# Altium schematic sheet RS485_tranceiver.SchDoc
size A3; SheetNumber: 6; SheetTotal: 7
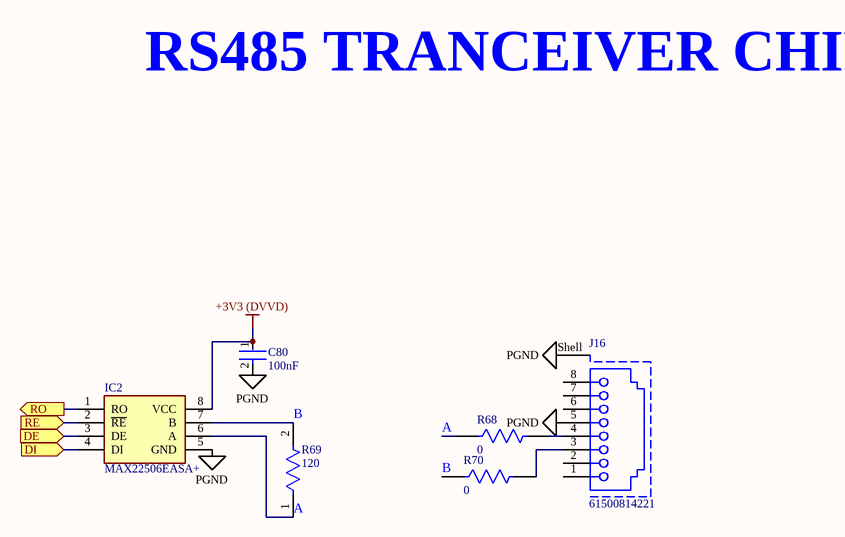
[diagram p0: RS485_tranceiver.SchDoc]

## Parts
C80  100nF  [FP-GRM15-MFG]
IC2  MAX22506EASA+  [SOIC127P600X175-8N]
J16  61500814221  [61500814221]
R68  0  [FP-CRCW1206-MFG]
R69  120  [FP-CRCW1206-MFG]
R70  0  [FP-CRCW1206-MFG]

## Ports
DE (in, see TOP_scheet[3C]), DI (in, see TOP_scheet[3C]), RE (in, see TOP_scheet[3C]), RO (out, see TOP_scheet[3C])

## Nets
+3V3 (DVVD): C80.1 IC2.8(VCC)
PGND: C80.2 IC2.5(GND) J16.5 J16.Shell
A: IC2.6(A) R68.1 R69.1
B: IC2.7(B) R69.2 R70.1
DE: IC2.3(DE) ; port DE
DI: IC2.4(DI) ; port DI
RE: IC2.2(~{RE}) ; port RE
RO: IC2.1(RO) ; port RO
NetJ16_3: J16.3 R70.2
NetJ16_4: J16.4 R68.2

Not connected (* = marked no-connect by the designer): J16 1 2 6 7 8

## Notes on the sheet
- RS485 TRANCEIVER CHIP

## Library data of the parts
C80 = CMP-2100-03641-2: CAP CER 0.1UF 16V X7R 0402; Manufacturer Part Number: GRM155R71C104KA88D; Manufacturer: Murata; Eurocircuits generic parts: GPC0402104; Standoff Height: 0mm; Tolerance: 10%; Voltage Rating: 16Vdc; Material: Ceramic; Capacitance: 0.10μF; Value: 0.10μF; RoHS: TRUE; Temperature Characteristic: X7R; Octopart: https://octopart.com/grm155r71c104ka88d-murata-196880; Digikey Description: CAP CER 0.1UF 16V X7R 0402; Device Class L3: Ceramic Capacitors; Height: 0.55mm; ComponentLink2Description: Datasheet; Temperature Range Low: -55°C; Ipc Land Pattern Name: CAPC10050X219; ComponentLink2URL: https://search.murata.co.jp/Ceramy/image/img/A01X/G101/ENG/GRM155R71H471KA01-01A.pdf; Device Class L1: Passive Components; Lead Free: yes; Category: Cap; Package: GRM15; Temperature: -55°C to +125°C; Device Class L2: Capacitors; Temperature Range High: +125°C; Mouser Description: 0402 0.1 uF 16V ±10 % Tolerance X7R SMT Multilayer Ceramic Capacitor
IC2 = MAX22506EASA+: Integrated Circuit; Manufacturer_Name: Analog Devices; Datasheet Link: https://datasheets.maximintegrated.com/en/ds/MAX22506E.pdf; Height: 1.75mm; Manufacturer_Part_Number: MAX22506EASA+; Mouser Part Number: 700-MAX22506EASA+; Mouser Price/Stock: https://www.mouser.co.uk/ProductDetail/Analog-Devices-Maxim-Integrated/MAX22506EASA%2b?qs=DRkmTr78QARfKAj85YrvXQ%3D%3D; Arrow Part Number: MAX22506EASA+; Arrow Price/Stock: https://www.arrow.com/en/products/max22506easa/maxim-integrated?region=nac
J16 = CMP-1502-01695-2: NexarPartId: 8917800; Number of Contacts: 8; Operating Supply Voltage: 120V; Gender: Female; Contact Resistance: 20mΩ; Number of Ports: 1; Direction: Down; Shielding: Shielded; Insulation Resistance: 500MΩ; Current Rating: 1.5A; Connector Type: RJ45, Socket; Mount: PCB, Through Hole; Housing Material: PBT; RoHS: Compliant; Depth: 21.2mm; Max Operating Temperature: 85°C; Contact Material: Copper; REACH SVHC: Unknown; Voltage Rating (DC): 120V; Orientation: Right Angle; Number of Positions: 8; Number of Rows: 1; Insulation Material: PBT; Width: 15.88mm; Flammability Rating: UL94 V-0; Termination: Through Hole; Min Operating Temperature: -40°C; Voltage Rating (AC): 120V; Length: 13.65mm; Height: 19.95mm; Contact Plating: Gold; Color: Black
R68 R70 = CMP-00030-39388935-1: CRCW12060000ZSTA Zero Ohm Resistor, Jumper, 1206 [3216 Metric], Thick Film, 250 mW, Surface Mount; Voltage Rating (DC): 200V; Max Power Dissipation: 250mW; Temperature Coefficient: 100ppm/°C; Resistance: 0Ω; Packaging: Cut Tape; Lead Free: Contains Lead; Height: 609.6µm; Military Standard: Not; Min Operating Temperature: -55°C; Weight: 10.007382mg; Depth: 1.6mm; Termination: SMD/SMT; Mount: Surface Mount; RoHS: Compliant; Case Code (Metric): 3216; Max Operating Temperature: 155°C; NexarPartId: 39388935; Length: 3.2mm; Features: Automotive AEC-Q200; Case Code (Imperial): 1206; Composition: Thick Film; Case/Package: 1206; Voltage Rating: 200V; Width: 1.6mm; Contact Plating: Lead, Tin; Number of Terminations: 2; REACH SVHC: Unknown; Power Rating: 250mW; Radiation Hardening: No
R69 = CMP-00030-39388935-1: CRCW12060000ZS120 Ohm Resistor, Jumper, 1206 [3216 Metric], Thick Film, 250 mW, Surface Mount; Voltage Rating (DC): 200V; Max Power Dissipation: 250mW; Temperature Coefficient: 100ppm/°C; Resistance: 120Ω; Packaging: Cut Tape; Lead Free: Contains Lead; Height: 609.6µm; Military Standard: Not; Min Operating Temperature: -55°C; Weight: 10.007382mg; Depth: 1.6mm; Termination: SMD/SMT; Mount: Surface Mount; RoHS: Compliant; Case Code (Metric): 3216; Max Operating Temperature: 155°C; NexarPartId: 39388935; Length: 3.2mm; Features: Automotive AEC-Q200; Case Code (Imperial): 1206; Composition: Thick Film; Case/Package: 1206; Voltage Rating: 200V; Width: 1.6mm; Contact Plating: Lead, Tin; Number of Terminations: 2; REACH SVHC: Unknown; Power Rating: 250mW; Radiation Hardening: No